# Altium schematic sheet RPI_CM4.SchDoc
size C; SheetNumber: 2; SheetTotal: 2
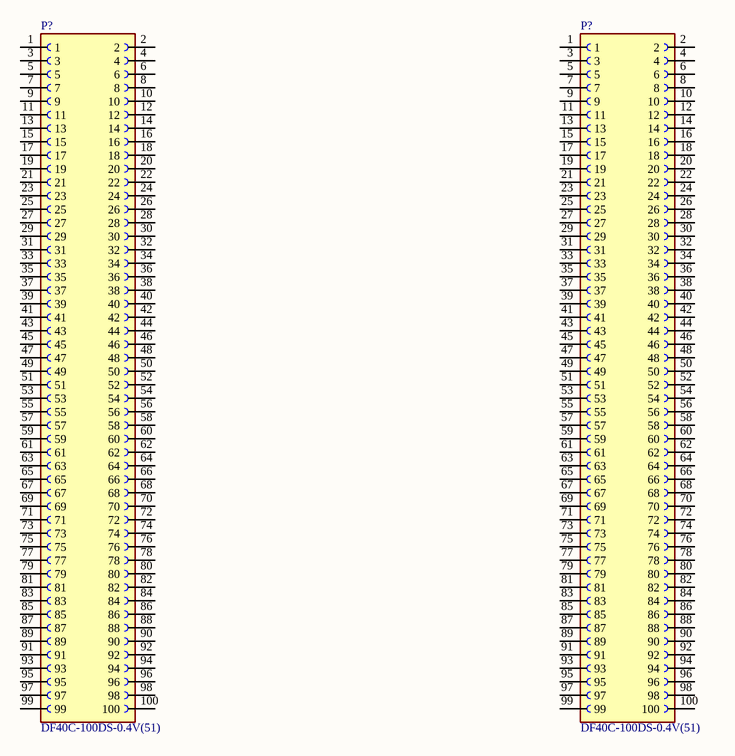
[diagram p0: RPI_CM4.SchDoc]

## Parts
(Parts that share a designator on the sheet are numbered #1, #2 ... from top to bottom, then left to right.)
P?#1  DF40C-100DS-0.4V(51)  [DF40C-100DS-0.4V(51)-Footprint-1]
P?#2  DF40C-100DS-0.4V(51)  [DF40C-100DS-0.4V(51)-Footprint-1]

## Nets

Not connected (* = marked no-connect by the designer): P?#1 1 2 3 4 5 6 7 8 9 10 11 12 13 14 15 16 17 18 19 20 21 22 23 24 25 26 27 28 29 30 31 32 33 34 35 36 37 38 39 40 41 42 43 44 45 46 47 48 49 50 51 52 53 54 55 56 57 58 59 60 61 62 63 64 65 66 67 68 69 70 71 72 73 74 75 76 77 78 79 80 81 82 83 84 85 86 87 88 89 90 91 92 93 94 95 96 97 98 99 100; P?#2 1 2 3 4 5 6 7 8 9 10 11 12 13 14 15 16 17 18 19 20 21 22 23 24 25 26 27 28 29 30 31 32 33 34 35 36 37 38 39 40 41 42 43 44 45 46 47 48 49 50 51 52 53 54 55 56 57 58 59 60 61 62 63 64 65 66 67 68 69 70 71 72 73 74 75 76 77 78 79 80 81 82 83 84 85 86 87 88 89 90 91 92 93 94 95 96 97 98 99 100

## Library data of the parts
P?#1 P?#2 = CMP-002-00073-2: Board Connector, 100 Contact(s), 2 Row(s), Female, Straight, 0.016 inch Pitch, Surface Mount Terminal, Locking, Black Insulator, Receptacle; Min Operating Temperature: -35°C; Max Operating Temperature: 85°C; RoHS Compliant: Yes; Connector Type: BOARD CONNECTOR; Mounting Technology: Board